# Altium schematic sheet Micro y BT.SchDoc
size A2
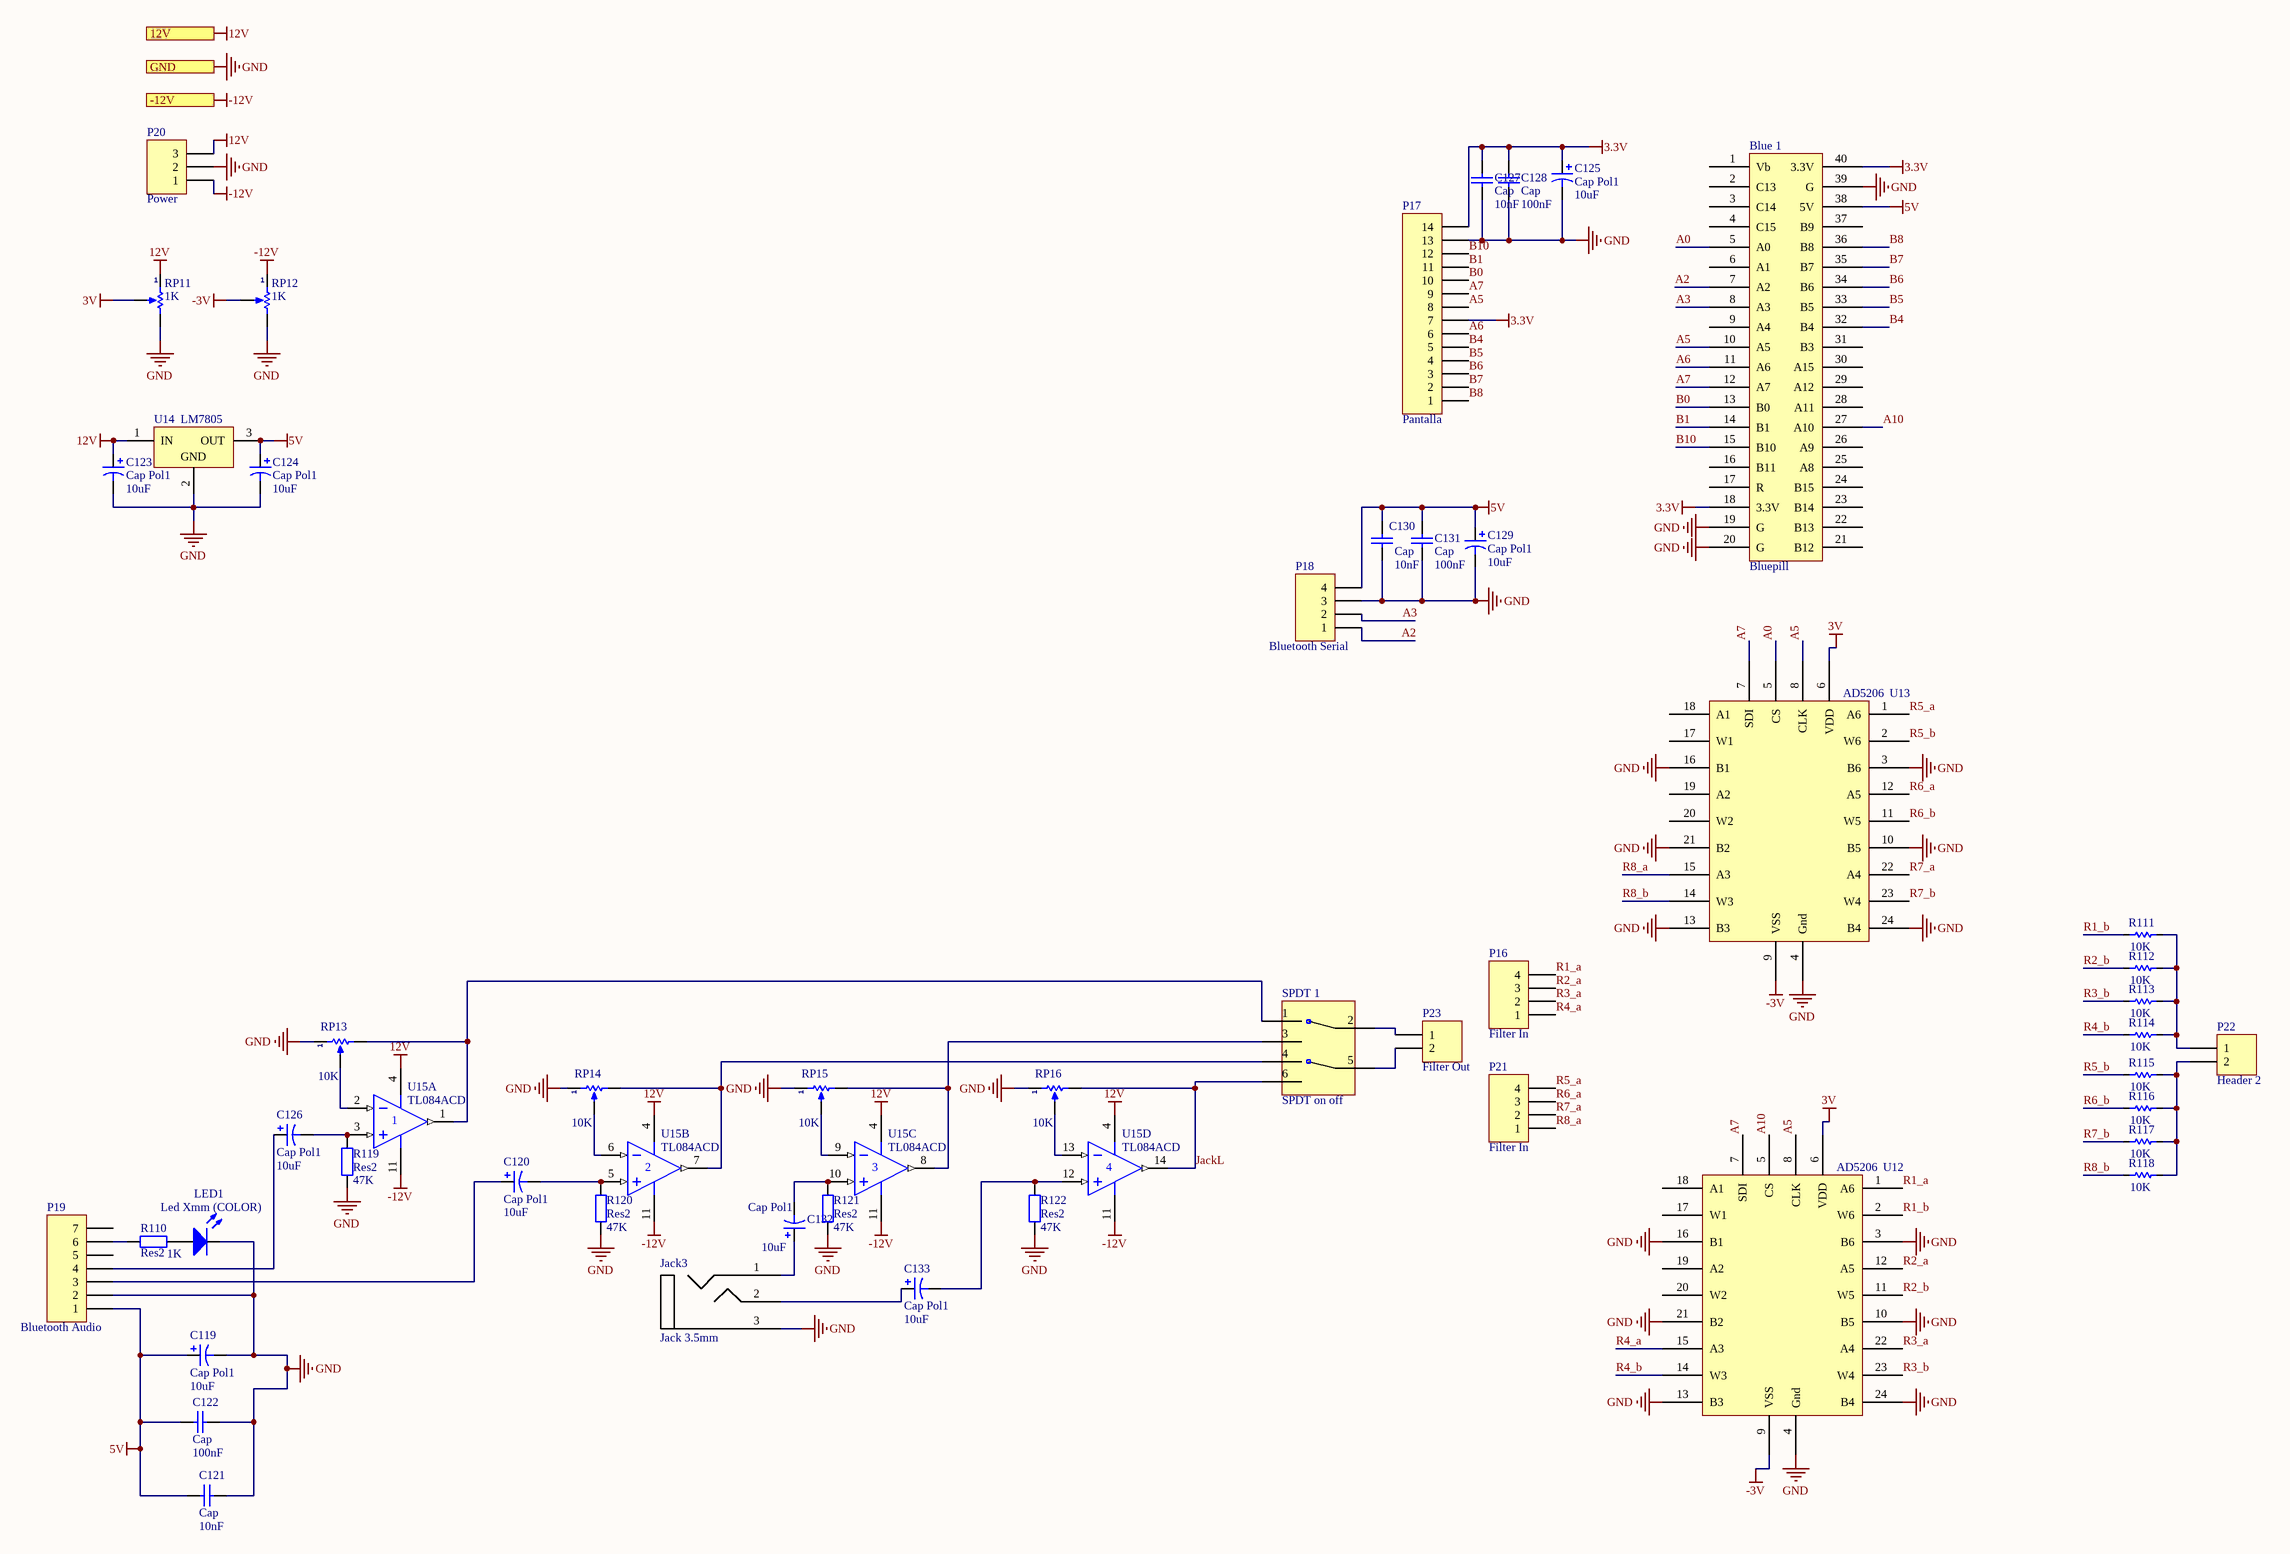
[diagram p0: Micro y BT.SchDoc]

## Parts
Blue_1  Bluepill  [Bluepill]
C119  Cap Pol1  value 10uF  [CAPR D250 H450 R100 mil]
C120  Cap Pol1  value 10uF  [CAPR D250 H450 R100 mil]
C121  Cap  value 10nF  [cap 3]
C122  Cap  value 100nF  [CAP DISCO 200mil]
C123  Cap Pol1  value 10uF  [CAPR D250 H450 R100 mil]
C124  Cap Pol1  value 10uF  [CAPR D250 H450 R100 mil]
C125  Cap Pol1  value 10uF  [CAPR D250 H450 R100 mil]
C126  Cap Pol1  value 10uF  [CAPR D250 H450 R100 mil]
C127  Cap  value 10nF  [RAD-0.3]
C128  Cap  value 100nF  [CAP DISCO 200mil]
C129  Cap Pol1  value 10uF  [CAPR D250 H450 R100 mil]
C130  Cap  value 10nF  [cap 3]
C131  Cap  value 100nF  [CAP DISCO 200mil]
C132  Cap Pol1  value 10uF  [CAPR D250 H450 R100 mil]
C133  Cap Pol1  value 10uF  [CAPR D250 H450 R100 mil]
Jack3  Jack 3.5mm  [jack 3.5mm]
LED1  VALOR: Led Xmm (COLOR)  [Led 3mm AMARILLO]  (hidden comment: Diodo Led)
P16  Filter In  [Bornera 4]
P17  Pantalla  [HDR1X14]
P18  Bluetooth Serial  [HDR1X4]
P19  Bluetooth Audio  [HDR1X7]
P20  Power  [HDR1X3]
P21  Filter In  [Bornera 4]
P22  Header 2  [HDR1X2]
P23  Filter Out  [HDR1X2]
R110  Res2  value 1K  [1206 resistor]
R111  VALOR: 10K  [1206 resistor]  (hidden comment: Res SMD)
R112  VALOR: 10K  [1206 resistor]  (hidden comment: Res SMD)
R113  VALOR: 10K  [1206 resistor]  (hidden comment: Res SMD)
R114  VALOR: 10K  [1206 resistor]  (hidden comment: Res SMD)
R115  VALOR: 10K  [1206 resistor]  (hidden comment: Res SMD)
R116  VALOR: 10K  [1206 resistor]  (hidden comment: Res SMD)
R117  VALOR: 10K  [1206 resistor]  (hidden comment: Res SMD)
R118  VALOR: 10K  [1206 resistor]  (hidden comment: Res SMD)
R119  Res2  value 47K  [1206 resistor]
R120  Res2  value 47K  [1206 resistor]
R121  Res2  value 47K  [1206 resistor]
R122  Res2  value 47K  [1206 resistor]
RP11  VALOR: 1K  [Trimpot Multivuelta Vertical]  (hidden comment: Trimpot)
RP12  VALOR: 1K  [Trimpot Multivuelta Vertical]  (hidden comment: Trimpot)
RP13  VALOR: 10K  [Trimpot Multivuelta Vertical]  (hidden comment: Trimpot)
RP14  VALOR: 10K  [Trimpot Multivuelta Vertical]  (hidden comment: Trimpot)
RP15  VALOR: 10K  [Trimpot Multivuelta Vertical]  (hidden comment: Trimpot)
RP16  VALOR: 10K  [Trimpot Multivuelta Vertical]  (hidden comment: Trimpot)
SPDT_1  SPDT on off  [DIP-6]
U12  AD5206  [948H-01]
U13  AD5206  [948H-01]
U14  LM7805  [TO-220_FullPak]
U15  TL084ACD  [751A-02_N]  (parts A,B,C,D of 4)

## Ports
12V, -12V, GND

## Nets
3.3V: Blue_1.18(3.3V) Blue_1.40(3.3V) C125.1 C127.2 C128.2 P17.7 P17.14
3V: RP11.3(TAP) U12.6(VDD) U13.6(VDD)
5V: Blue_1.38(5V) C119.1 C121.2 C122.2 C124.1 C129.1 C130.2 C131.2 P18.4 P19.1 U14.3(OUT)
12V: C123.1 P20.3 RP11.1(TOP) U14.1(IN) U15.4(V+) ; port 12V
-3V: RP12.3(TAP) U12.9(VSS) U13.9(VSS)
-12V: P20.1 RP12.1(TOP) U15.11(V-) ; port -12V
GND: Blue_1.19(G) Blue_1.20(G) Blue_1.39(G) C119.2 C121.1 C122.1 C123.2 C124.2 C125.2 C127.1 C128.1 C129.2 C130.1 C131.1 Jack3.3(Gnd) LED1.2(K) P17.13 P18.3 P19.2 P20.2 R119.1 R120.1 R121.1 R122.1 RP11.2(BOT) RP12.2(BOT) RP13.1(TOP) RP14.1(TOP) RP15.1(TOP) RP16.1(TOP) U12.3(B6) U12.4(Gnd) U12.10(B5) U12.13(B3) U12.16(B1) U12.21(B2) U12.24(B4) U13.3(B6) U13.4(Gnd) U13.10(B5) U13.13(B3) U13.16(B1) U13.21(B2) U13.24(B4) U14.2(GND) ; port GND
A0: Blue_1.5(A0) U13.5(CS)
A2: Blue_1.7(A2) P18.1
A3: Blue_1.8(A3) P18.2
A5: Blue_1.10(A5) P17.8 U12.8(CLK) U13.8(CLK)
A6: Blue_1.11(A6) P17.6
A7: Blue_1.12(A7) P17.9 U12.7(SDI) U13.7(SDI)
A10: Blue_1.27(A10) U12.5(CS)
B0: Blue_1.13(B0) P17.10
B1: Blue_1.14(B1) P17.11
B4: Blue_1.32(B4) P17.5
B5: Blue_1.33(B5) P17.4
B6: Blue_1.34(B6) P17.3
B7: Blue_1.35(B7) P17.2
B8: Blue_1.36(B8) P17.1
B10: Blue_1.15(B10) P17.12
JackL: RP16.2(BOT) SPDT_1.6 U15.14(OUT)
R1_a: P16.4 U12.1(A6)
R1_b: R111.1 U12.2(W6)
R2_a: P16.3 U12.12(A5)
R2_b: R112.1 U12.11(W5)
R3_a: P16.2 U12.22(A4)
R3_b: R113.1 U12.23(W4)
R4_a: P16.1 U12.15(A3)
R4_b: R114.1 U12.14(W3)
R5_a: P21.4 U13.1(A6)
R5_b: R115.1 U13.2(W6)
R6_a: P21.3 U13.12(A5)
R6_b: R116.1 U13.11(W5)
R7_a: P21.2 U13.22(A4)
R7_b: R117.1 U13.23(W4)
R8_a: P21.1 U13.15(A3)
R8_b: R118.1 U13.14(W3)
NetC120_1: C120.1 P19.3
NetC120_2: C120.2 R120.2 U15.5(IN+)
NetC126_1: C126.1 P19.4
NetC126_2: C126.2 R119.2 U15.3(IN+)
NetC132_1: C132.1 Jack3.1(R)
NetC132_2: C132.2 R121.2 U15.10(IN+)
NetC133_1: C133.1 Jack3.2(L)
NetC133_2: C133.2 R122.2 U15.12(IN+)
NetLED1_1: LED1.1(A) R110.1
NetP19_6: P19.6 R110.2
NetP22_1: P22.1 R111.2 R112.2 R113.2 R114.2
NetP22_2: P22.2 R115.2 R116.2 R117.2 R118.2
NetP23_1: P23.1 SPDT_1.2(B17)
NetP23_2: P23.2 SPDT_1.5
NetRP13_2: RP13.2(BOT) SPDT_1.1(B15) U15.1(OUT)
NetRP13_3: RP13.3(TAP) U15.2(IN-)
NetRP14_2: RP14.2(BOT) SPDT_1.4(B18) U15.7(OUT)
NetRP14_3: RP14.3(TAP) U15.6(IN-)
NetRP15_2: RP15.2(BOT) SPDT_1.3(B16) U15.8(OUT)
NetRP15_3: RP15.3(TAP) U15.9(IN-)
NetRP16_3: RP16.3(TAP) U15.13(IN-)

Not connected (* = marked no-connect by the designer): Blue_1 1(Vb) 2(C13) 3(C14) 4(C15) 6(A1) 9(A4) 16(B11) 17(R) 21(B12) 22(B13) 23(B14) 24(B15) 25(A8) 26(A9) 28(A11) 29(A12) 30(A15) 31(B3) 37(B9); P19 5 7; U12 17(W1) 18(A1) 19(A2) 20(W2); U13 17(W1) 18(A1) 19(A2) 20(W2)

## Library data of the parts
C119 C120 C123-C126 C129 C132 C133 = Cap Pol1: Polarized Capacitor (Radial); Published: 8-Jun-2000; LatestRevisionDate: 17-Jul-2002; LatestRevisionNote: Re-released for DXP Platform.; PackageReference: RB7.6-15; Publisher: Altium Limited; PackageDescription: Polarized Capacitor (Radial); 2 Leads
C121 C122 C127 C128 C130 C131 = Cap: Capacitor; Published: 8-Jun-2000; LatestRevisionDate: 17-Jul-2002; LatestRevisionNote: Re-released for DXP Platform.; PackageReference: RAD-0.3; Publisher: Altium Limited; PackageDescription: Radial Cap, Thru-Hole; 2 Leads; 0.3 in Pin Spacing
LED1 = Diodo Led: Led 3mm; FABRICANTE: Generico; CODIGO STI: *; PROVEEDOR: *; PART NUMBER: *
P16 P18 P21 = MHDR1X4: Header, 4-Pin; LatestRevisionDate: 17-Jul-2002; LatestRevisionNote: Re-released for DXP Platform.; Publisher: Altium Limited
P17 = Header 14: Header, 14-Pin; LatestRevisionDate: 17-Jul-2002; LatestRevisionNote: Re-released for DXP Platform.; Publisher: Altium Limited
P19 = Header 7: Header, 7-Pin; LatestRevisionDate: 17-Jul-2002; LatestRevisionNote: Re-released for DXP Platform.; Publisher: Altium Limited
P20 = Header 3: Header, 3-Pin; LatestRevisionDate: 17-Jul-2002; LatestRevisionNote: Re-released for DXP Platform.; Publisher: Altium Limited
P22 P23 = Header 2: Header, 2-Pin; LatestRevisionDate: 17-Jul-2002; LatestRevisionNote: Re-released for DXP Platform.; Publisher: Altium Limited
R110 R119-R122 = Res2: Resistor; Published: 8-Jun-2000; LatestRevisionDate: 17-Jul-2002; LatestRevisionNote: Re-released for DXP Platform.; PackageReference: AXIAL-0.4; Publisher: Altium Limited; PackageDescription: Axial Device, Thru-Hole; 2 Leads; 0.4 in Pin Spacing
RP11-RP16 = Trimpot: Preset; CODIGO STI: *; PROVEEDOR: *; FABRICANTE: *; PART NUMBER: *
U14 = LM78L12ACZ: 3-Terminal Positive Regulators, 3-pin TO-92; Manufacturer: National Semiconductor; PackageTopMarking: NSXYTT*LM78L*12ACZ; PowerWise: N; CompType: LDO IC; Published: 4-Dec-2008; DatasheetVersion: Apr-2006; PackageVersion: revG, Sep-2000; PackageReference: Z03A; Publisher: Altium Limited; PackageDescription: TO-92, Molded, 3 Lead; Supplier 1: Farnell; Supplier Part Number 1: 9490272; PartNumber: LM78L12ACZ; RoHS: N; PinCount: 3; Code_JEDEC: TO-226-AA; ComponentLink1Description: LM78L12 Datasheet; ComponentLink1URL: http://www.national.com/ds/LM/LM78L12.pdf; ComponentLink2Description: LM78L12 Web Page; ComponentLink2URL: http://www.national.com/pf/LM/LM78L12.html; ComponentLink3Description: Z03A Package Page; ComponentLink3URL: http://www.national.com/packaging/folders/z03a.html
U15 = TL084ACD: JFET-Input Operational Amplifier; Published: 17-Jul-2002; LatestRevisionDate: 13-Apr-2006; LatestRevisionNote: IPC-7351 Footprint Added.; DatasheetVersion: 1988; PackageVersion: 1991; PackageReference: 751A-02; Publisher: Altium Limited; PackageDescription: 14-Pin Small Outline Integrated Circuit 1.27 mm Pitch; Code_IPC: SOIC127P600-14; ComponentLink1Description: Manufacturer Link; ComponentLink1URL: http://www.onsemi.com/site/products/parametrics/0,4446,251,00.html
R111-R118 = Res SMD: CODIGO STI: *; PROVEEDOR: *; FABRICANTE: *; PART NUMBER: *